# EAGLE design KitchenTimer (EAGLE 9.2.1)
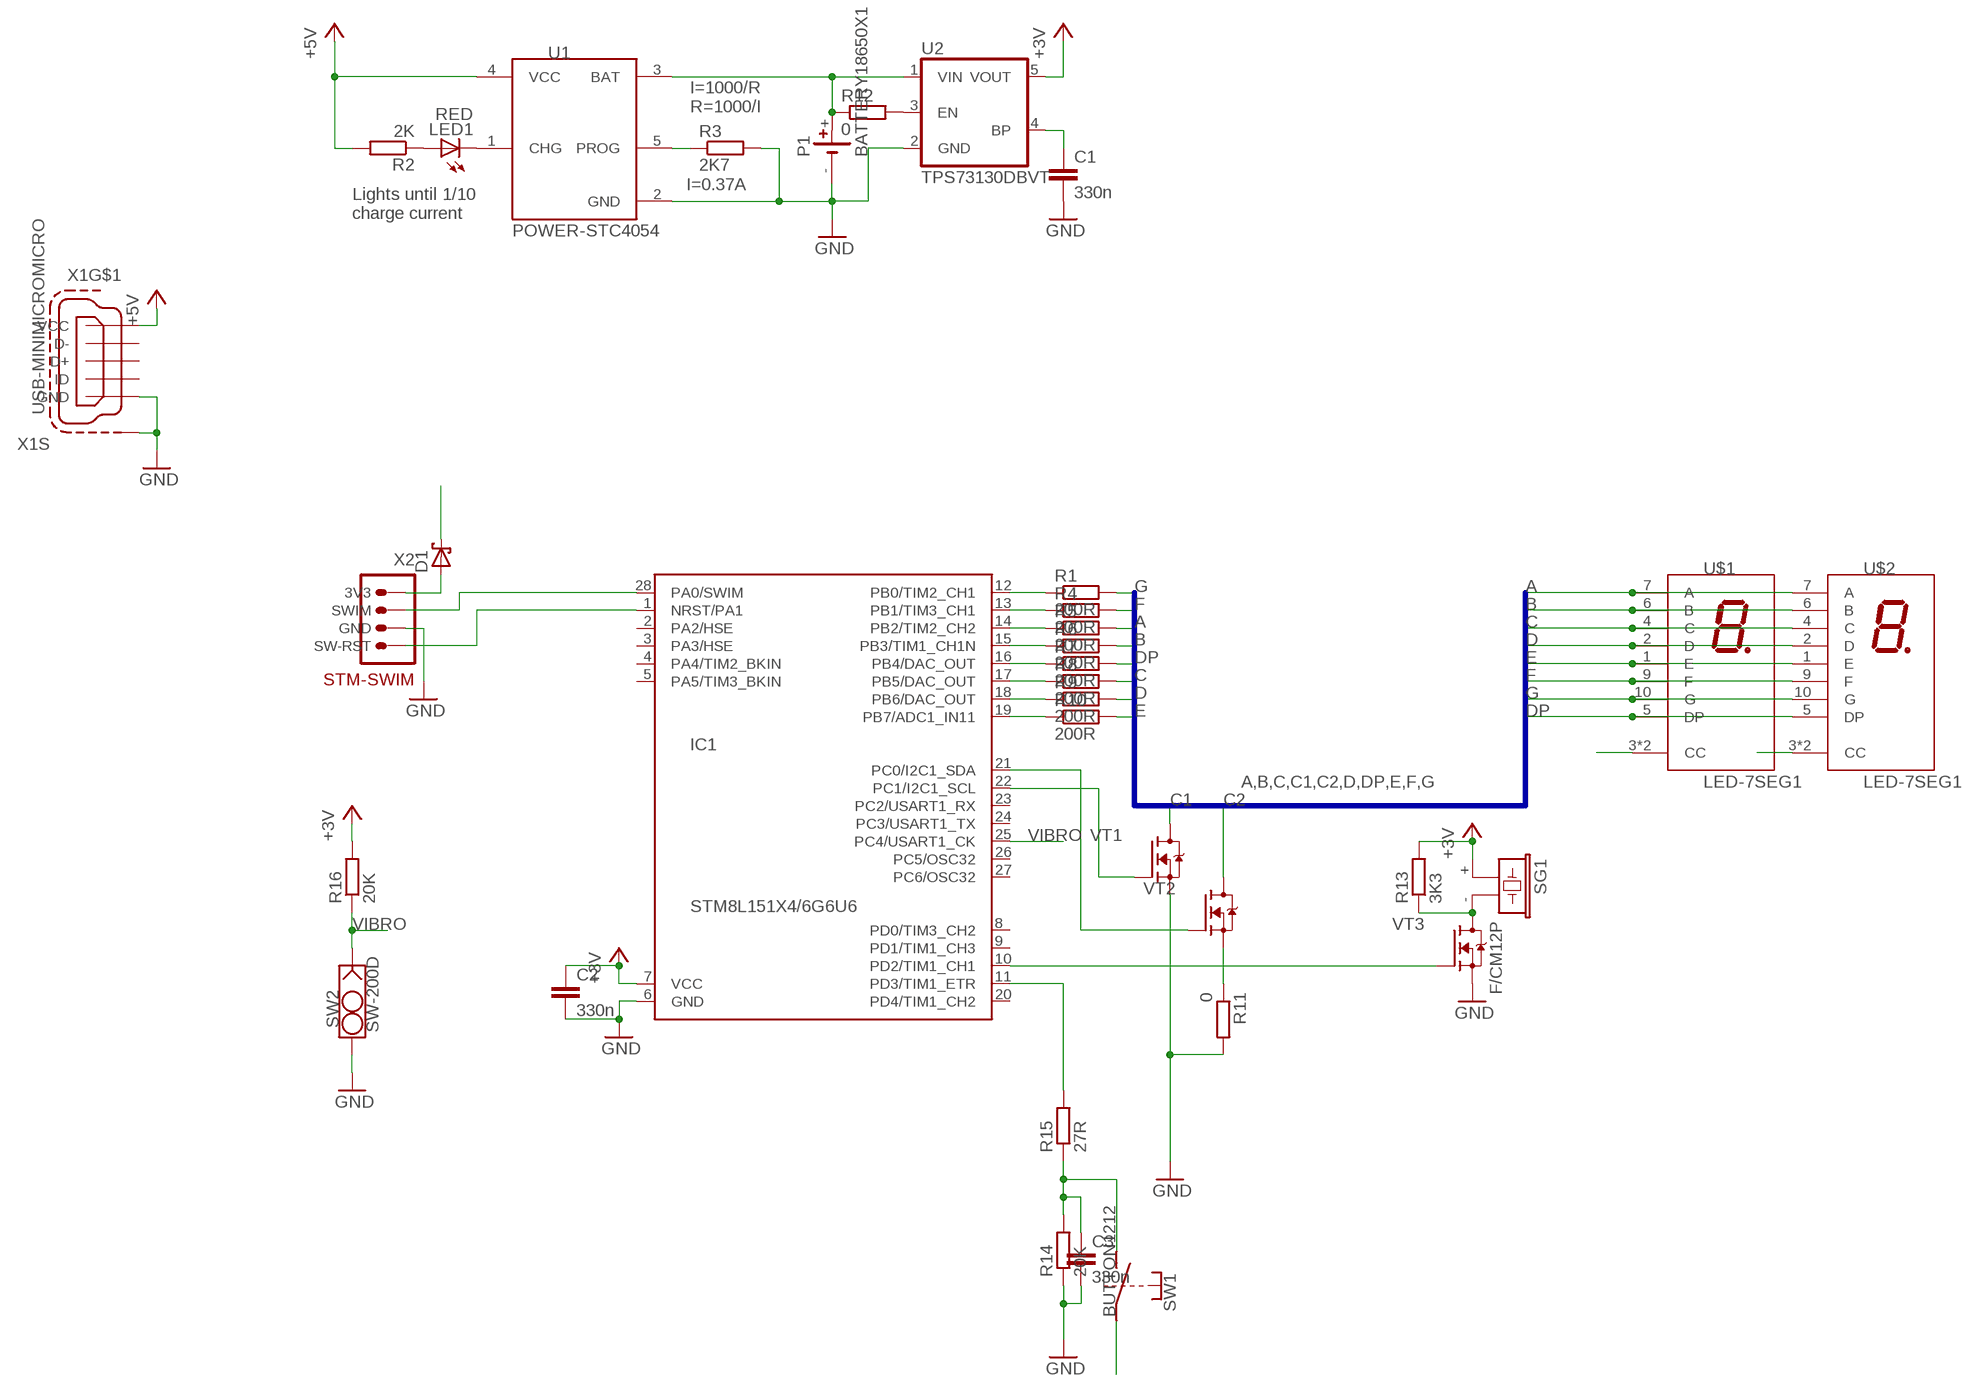
[diagram p0: schematic, sheet 1]

## Parts
C1  330n  CAP_1206  [CAP1206]
C2  330n  CAP_1206  [CAP1206]
C3  330n  CAP_1206  [CAP1206]
D1  DIODE-SH_SOD523  [SODFL1608X65]
IC1  STM8L151X4/6G6U6  [QFN28]
LED1  RED  LED_1206  [LED1206]
P1  BATTERY18650X1  [18650X1_HOLDER]
R1  200R  R_R0805  [RESC2012X50]
R2  2K  R_R0805  [RESC2012X50]
R3  2K7  R_R0805  [RESC2012X50]
R4  200R  R_R0805  [RESC2012X50]
R5  200R  R_R0805  [RESC2012X50]
R6  200R  R_R0805  [RESC2012X50]
R7  200R  R_R0805  [RESC2012X50]
R8  200R  R_R0805  [RESC2012X50]
R9  200R  R_R0805  [RESC2012X50]
R10  200R  R_R0805  [RESC2012X50]
R11  0  R_R0805  [RESC2012X50]
R12  0  R_R0805  [RESC2012X50]
R13  3K3  R_R1206  [RESC3216X60]
R14  20K  R_R1206  [RESC3216X60]
R15  27R  R_R1206  [RESC3216X60]
R16  20K  R_R1206  [RESC3216X60]
SG1  F/CM12P  [F/CM12P]
SW1  BUTTON1212  [B3F-40XX]
SW2  SW-200D  [SW-200D]
U1  POWER-STC4054  [SOT95P280X145-5]
U2  TPS73130DBVT  VREG-LD2985  [SOT95P280X145-5]
U$1  LED-7SEG1  [LED-7SEG1]
U$2  LED-7SEG1  [LED-7SEG1]
VT1  FET-NSOT-23  [SOT95P240X115-3]
VT2  FET-NSOT-23  [SOT95P240X115-3]
VT3  FET-NSOT-23  [SOT95P240X115-3]
X1  USB-MINIMICROMICRO  [USB-B-MICRO-SMD]
X2  STM-SWIMPOGOPADS  [SWIM-PADS-1.27]

## Nets
+3V: C2.1 D1.1(C) IC1.7(VCC) R13.2 R16.2 SG1.+ SW1.1 SW1.2 U2.5(VOUT)
+5V: R2.2 U1.4(VCC) X1.VBUS(VCC)
A: R5.2 U$1.7(A) U$2.7(A)
B: R6.2 U$1.6(B) U$2.6(B)
C: R8.2 U$1.4(C) U$2.4(C)
C1: U$1.3(CC) U$1.8(CC) VT1.3(D)
C2: U$2.3(CC) U$2.8(CC) VT2.3(D)
D: R9.2 U$1.2(D) U$2.2(D)
DP: R7.2 U$1.5(DP) U$2.5(DP)
E: R10.2 U$1.1(E) U$2.1(E)
F: R4.2 U$1.9(F) U$2.9(F)
G: R1.2 U$1.10(G) U$2.10(G)
GND: C1.2 C2.2 C3.2 IC1.6(GND) P1.- R3.2 R11.2 R14.1 SW2.S U1.2(GND) U2.2(GND) VT1.2(S) VT3.2(S) X1.GND X1.SHIELD1(S:S1) X1.SHIELD2(S:S1) X1.SHIELD3(S:S1) X2.P$3(GND)
N$1: LED1.C U1.1(CHG)
N$2: LED1.A R2.1
N$3: IC1.12(PB0/TIM2_CH1) R1.1
N$4: IC1.13(PB1/TIM3_CH1) R4.1
N$5: R3.1 U1.5(PROG)
N$6: IC1.14(PB2/TIM2_CH2) R5.1
N$7: P1.+ R12.1 U1.3(BAT) U2.1(VIN)
N$8: IC1.15(PB3/TIM1_CH1N) R6.1
N$9: IC1.16(PB4/DAC_OUT) R7.1
N$10: IC1.17(PB5/DAC_OUT) R8.1
N$11: IC1.18(PB6/DAC_OUT) R9.1
N$12: IC1.19(PB7/ADC1_IN11) R10.1
N$13: IC1.22(PC1/I2C1_SCL) VT1.1(G)
N$14: IC1.21(PC0/I2C1_SDA) VT2.1(G)
N$15: R11.1 VT2.2(S)
N$16: R12.2 U2.3(EN)
N$17: C1.1 U2.4(BP)
N$18: R13.1 SG1.- VT3.3(D)
N$19: IC1.10(PD2/TIM1_CH1) VT3.1(G)
N$20: C3.1 R14.2 R15.1 SW1.3 SW1.4
N$21: IC1.11(PD3/TIM1_ETR) R15.2
N$22: IC1.28(PA0/SWIM) X2.P$2(SWIM)
N$23: IC1.1(NRST/PA1) X2.P$4(SW-RST)
N$24: D1.2(A) X2.P$1(3V3)
VIBRO: IC1.25(PC4/USART1_CK) R16.1 SW2.G
Unconnected: IC1.2(PA2/HSE) IC1.3(PA3/HSE) IC1.4(PA4/TIM2_BKIN) IC1.5(PA5/TIM3_BKIN) IC1.8(PD0/TIM3_CH2) IC1.9(PD1/TIM1_CH3) IC1.20(PD4/TIM1_CH2) IC1.23(PC2/USART1_RX) IC1.24(PC3/USART1_TX) IC1.26(PC5/OSC32) IC1.27(PC6/OSC32) X1.D+ X1.D- X1.ID

## Buses
A,B,C,C1,C2,D,DP,E,F,G

## Notes on the sheet
- I=1000/R
  R=1000/I
- I=0.37A
- Lights until 1/10
  charge current

## Library data of the parts
C1-C3 = Flamberm:CAP_
D1 = Flamberm:DIODE-SH_
IC1 = Flamberm:STM8L151X4/6
LED1 = Flamberm:LED_
P1 = Flamberm:BATTERY
R1-R16 = Flamberm:R_
SG1 = buzzer:F/CM12P: BUZZER Source: Buerklin; OC_FARNELL: unknown; OC_NEWARK: unknown
SW1 = Flamberm:BUTTON
SW2 = Flamberm:SW-200D
U1 = Flamberm:POWER-STC4054
U2 = Flamberm:VREG-LD2985
U$1 U$2 = Flamberm:LED-7SEG1
VT1-VT3 = Flamberm:FET-N
X1 = Flamberm:USB-MINIMICRO: MINI USB-B Conector Source: www.cypressindustries.com
X2 = Flamberm:STM-SWIM

## Board
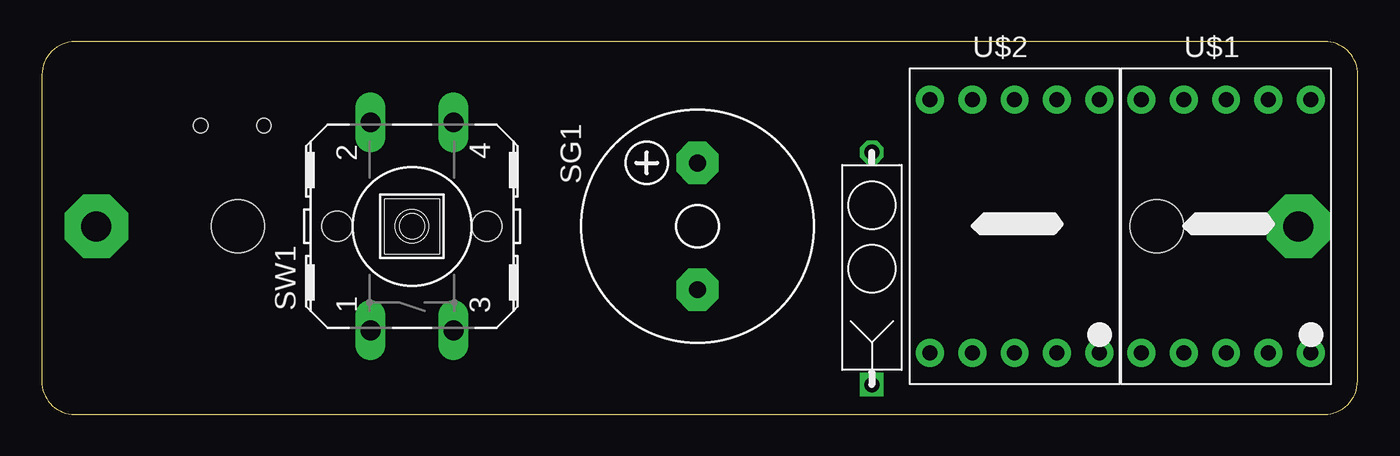
[diagram p1: board, top side]
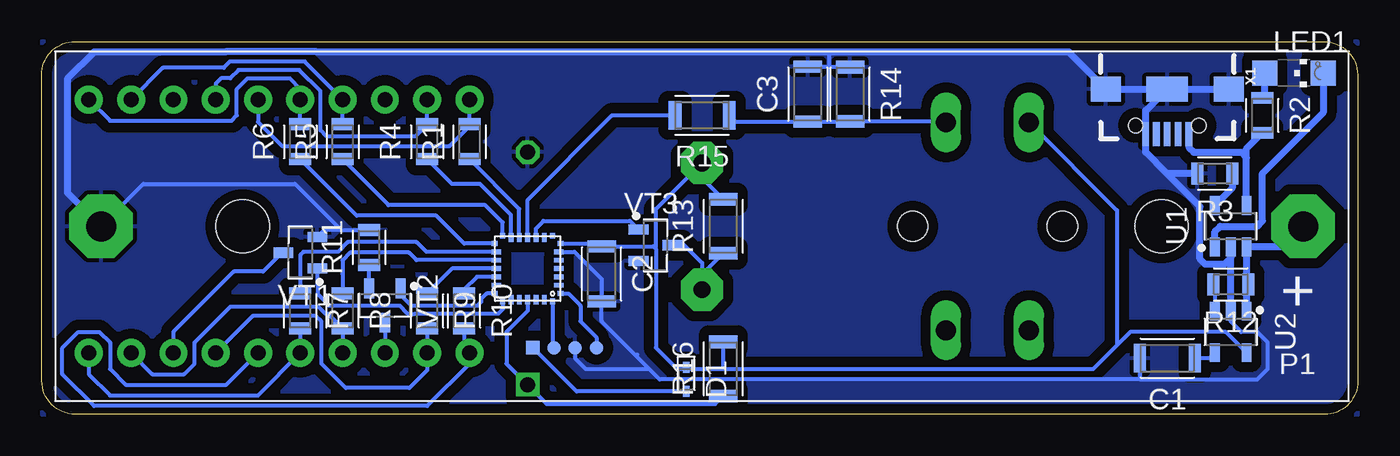
[diagram p2: board, bottom side, seen from below]

Size 79.06 x 22.4 mm. Coordinates in mm from the lower left corner, seen from the top.
Outline: 2,0 77.04,0 arc90 79.04,2 79.06,20.4 arc90 77.06,22.4 2.02,22.4 arc90 0.02,20.4 0,2 arc90 2,0
Copper layers (1*16): Top 0.035mm / dielectric 1.5mm / Bottom 0.035mm
Design rules "EagleDesignRules": minimum track width 0.25mm, minimum drill 0.3mm, track to track 0.25mm, track to pad 0.25mm, pad to pad 0.25mm, via to via 0.25mm, smd to smd 0.25mm, copper to edge 0.5mm, drill to drill 0.5mm, minimum pad ring 10mil, minimum via ring 8mil, stop-mask expansion 4mil, vias tented up to drill 0mil, thermal gap 0.25mm

### Footprints (pad centres in the part's own frame; a part is rotated, then mirrored left to right if it is on the bottom)
CAP1206 = smd 0.712 x 1.712: 1 -1.65,0; 2 1.65,0
SODFL1608X65 = smd 0.66 x 0.398: 1 -0.72,0; 2 0.72,0
QFN28 = smd 0.35 x 0.29: 1 -1.975,1.5; 7 -1.975,-1.5; 15 1.975,-1.5; 21 1.975,1.5 | smd 0.55 x 0.29: 2 -1.875,1; 3 -1.875,0.5; 4 -1.875,0; 5 -1.875,-0.5; 6 -1.875,-1; 16 1.875,-1; 17 1.875,-0.5; 18 1.875,0; 19 1.875,0.5; 20 1.875,1 | smd 0.29 x 0.35: 8 -1.5,-1.975; 14 1.5,-1.975; 22 1.5,1.975; 28 -1.5,1.975 | smd 0.29 x 0.55: 9 -1,-1.875; 10 -0.5,-1.875; 11 0,-1.875; 12 0.5,-1.875; 13 1,-1.875; 23 1,1.875; 24 0.5,1.875; 25 0,1.875; 26 -0.5,1.875; 27 -1,1.875
LED1206 = smd 1.5 x 1.5: A 0,-1.75; C 0,1.75
18650X1_HOLDER = drill 1.8 pad 3.81 octagon: + -36.1,0; - 36.1,0 | hole 3.2: -27.6,0; 27.6,0
RESC2012X50 = smd 0.712 x 1.312: 1 -1.05,0; 2 1.05,0
RESC3216X60 = smd 0.762 x 1.712: 1 -1.625,0; 2 1.625,0
F/CM12P = drill 1.016 pad 2.54 octagon: + 3.81,0; - -3.81,0
B3F-40XX = drill 1.194 long: 1 -6.248,2.489; 2 6.248,2.489; 3 -6.248,-2.489; 4 6.248,-2.489 | hole 1.803: 0,-4.496; 0,4.496
SW-200D = drill 0.9 square: G 6.985,0 | drill 0.9 octagon: S -6.985,0
SOT95P280X145-5 = smd 1.127 x 0.589: 1 -1.242,0.95; 2 -1.242,0; 3 -1.242,-0.95; 4 1.242,-0.95; 5 1.242,0.95
LED-7SEG1 = drill 0.9 pad 1.676: 1 -5.08,-7.62; 2 -2.54,-7.62; 3 0,-7.62; 4 2.54,-7.62; 5 5.08,-7.62; 6 5.08,7.62; 7 2.54,7.62; 8 0,7.62; 9 -2.54,7.62; 10 -5.08,7.62
SOT95P240X115-3 = smd 1.18 x 0.609: 1 -1.024,0.95; 2 -1.024,-0.95; 3 1.024,0
USB-B-MICRO-SMD = smd 1.45 x 0.4: D+ 2.725,0; D- 2.725,0.65; GND 2.725,-1.3; ID 2.725,-0.65; VBUS 2.725,1.3 | smd 1.5 x 1.8: SHIELD1 0,3.685; SHIELD2 0,-3.685 | smd 1.5 x 2.5: SHIELD3 0,0 | hole 0.85: 2.2,1.9; 2.2,-1.9
SWIM-PADS-1.27 = smd 0.8 x 0.8: P$1 -1.27,0; P$2 0,0; P$3 1.27,0; P$4 2.54,0

### Placement (x,y rotation side)
C1  11.45,3.37 180 bottom
C2  45.42,8.45 270 bottom
C3  33.04,19.24 90 bottom
D1  40.34,2.1 270 bottom
IC1  49.87,8.76 180 bottom
LED1  3.83,20.51 270 bottom
P1  39.39,11.3 180 bottom
R1  53.36,16.38 90 bottom
R2  5.73,17.97 270 bottom
R3  8.59,14.48 180 bottom
R4  55.9,16.38 90 bottom
R5  60.98,16.38 90 bottom
R6  63.52,16.38 90 bottom
R7  63.52,6.22 270 bottom
R8  60.98,6.22 270 bottom
R9  55.9,6.22 270 bottom
R10  53.68,6.22 270 bottom
R11  59.39,10.03 90 bottom
R12  7.64,7.81 180 bottom
R13  38.12,11.3 90 bottom
R14  30.5,19.24 270 bottom
R15  39.39,17.97 180 bottom
R16  38.12,2.73 90 bottom
SG1  39.39,11.3 90 top
SW1  22.24,11.3 90 top
SW2  49.87,8.76 270 top
U1  7.64,11.3 90 bottom
U2  7.64,4.95 270 bottom
U$1  71.14,11.3 0 top
U$2  58.44,11.3 0 top
VT1  63.52,9.72 180 bottom
VT2  58.44,6.54 270 bottom
VT3  42.18,10.16 0 bottom
X1  11.45,19.56 270 bottom
X2  48.28,4 0 bottom

### Tracks (layer width: path | path; a pad name or v marks a point on that pad's centre or on a via)
+3V
  Bottom 0.25: U2.5 7.93,4.95 13.67,4.95 14.47,4.16 | 40.34,2.73 40.89,2.73 42.16,4 42.16,9.94 | 40.34,2.73 38.12,2.73 | 38.12,2.73 35.26,2.73 15.89,2.73 14.47,4.16 | IC1.7 45.59,10.26 C2.1 42.31,10.1 42.16,9.94 | 42.16,9.94 42.16,12.34 SG1.+ 39.39,14.2 R13.2 | SW1.2 14.47,12.26 14.47,4.16 | D1.1 40.34,2.73 | R16.2 38.12,2.73
+5V
  Bottom 0.406: U1.4 6.69,15.43 | 6.69,15.43 6.69,15.97 R2.2 | X1.VBUS 10.15,16.04 9.86,15.75 7.01,15.75 6.69,15.43
A
  Bottom 0.254: R5.2 U$2.7 63.26,21.2 67.75,21.2 68.12,20.83 71.77,20.83 U$1.7
B
  Bottom 0.254: R6.2 U$2.6 63.52,19.56 64.15,20.19 66.69,20.19 67.33,19.56 67.33,17.97 67.65,17.65 74.95,17.65 U$1.6
C
  Bottom 0.254: U$2.4 R8.2 61.84,6.04 62,6.04 62.44,6.47 67.71,6.47 69.87,4.32 69.87,3.05 70.5,2.41 72.41,2.41 U$1.4
C1
  Bottom 0.25: 67.52,8.57 65.76,8.57 64.62,9.71 VT1.3
  Bottom 0.254: 67.52,8.57 71.14,4.95 U$1.3
C2
  Bottom 0.25: VT2.3 U$2.3
D
  Bottom 0.254: R9.2 U$2.2 55.9,2.65 56.96,1.59 60.79,1.59 62.25,3.05 62.25,5.57 62.58,5.91 66.38,5.91 U$1.2
DP
  Bottom 0.254: R7.2 U$2.5 66.06,1.14 74.95,1.14 76.22,2.41 U$1.5
E
  Bottom 0.254: R10.2 53.68,4 U$2.1 53.36,3.05 55.9,0.51 75.9,0.51 77.81,2.41 77.81,4 76.85,4.95 75.58,4.95 74.95,4.32 74.95,2.73 74,1.78 67.96,1.78 U$1.1
F
  Bottom 0.254: U$2.9 R4.2 56.63,16.7 60.17,16.7 61.93,16.7 62.3,17.07 62.3,19.43 63.57,20.7 67.22,20.7 67.72,20.19 68.28,20.19 68.6,19.88 U$1.9
G
  Bottom 0.254: U$2.10 R1.2 53.36,17.34 54.56,16.13 64.62,16.13 66.06,17.58 U$1.10
GND
  Bottom 0.25: P1.- 72.95,13.84 63.84,13.84 61.08,11.08 | 61.08,11.08 R11.2 | U2.2 7.64,5.59 7,4.95 6.05,4.95 5.42,4.32 5.42,2.73 6.05,2.1 13.04,2.1 | 13.04,2.1 41.93,2.1 42.56,2.73 | C1.2 13.1,2.16 13.04,2.1 | 42.56,2.73 43.36,3.52 | 43.36,3.52 45.42,5.59 C2.2 45.42,8.13 47.06,9.76 IC1.6 | 43.28,3.6 43.36,3.52 | C3.2 31.77,20.89 | 31.77,20.89 30.52,20.89 R14.1 | 31.77,21.78 31.77,20.89 | X2.P$3 47.01,3.37 46.37,2.73 42.56,2.73 | VT1.2 62.08,11.08 61.08,11.08
  Bottom 0.406: X1.SHIELD3 12.75,18.26 X1.GND 12.75,15.75 11.46,14.46 | X1.SHIELD3 X1.SHIELD2 17.36,21.78 31.77,21.78 62.54,21.78 67.99,21.78 75.9,21.78 77.51,20.17 77.51,13.32 P1.- | X1.SHIELD3 X1.SHIELD1 | U1.2 7.64,9.4 | 7.64,9.4 8.02,9.02 9.16,9.02 9.49,9.34 9.49,12.48 11.46,14.46 | R3.2 9.66,14.46 11.46,14.46 | U2.2 7.64,9.4
  pour Bottom (isolate 0.61, rank 6): 0,0 0.02,22.4 79.06,22.4 79.04,0
N$1
  Bottom 0.406: LED1.C 2.08,18.13 5.73,14.48 5.73,11.62 6.05,11.3 8.27,11.3 8.59,10.99 U1.1
N$2
  Bottom 0.406: R2.1 5.58,19.18 LED1.A
N$3
  Bottom 0.254: IC1.12 50.37,12.34 R1.1
N$4
  Bottom 0.254: IC1.13 50.87,11.99 52.72,13.84 54.41,13.84 R4.1
N$5
  Bottom 0.406: R3.1 7.54,13.59 U1.5
N$6
  Bottom 0.254: IC1.14 51.37,11.53 52.41,12.57 58.22,12.57 R5.1
N$7
  Bottom 0.25: R12.1 6.69,7.81
  Bottom 0.406: P1.+ 4.53,10.06 U1.3 6.69,7.81 U2.1
N$8
  Bottom 0.25: 53.68,10.26 55.35,11.94 60.12,11.94 60.39,12.21
  Bottom 0.254: IC1.15 53.68,10.26 | 60.39,12.21 R6.1
N$9
  Bottom 0.25: 54.31,9.76 55.95,9.76 56.53,10.35 60.66,10.35 61.25,9.76 61.61,9.76
  Bottom 0.254: R7.1 63.52,9.57 63.33,9.76 61.61,9.76 | IC1.16 54.31,9.76
N$10
  Bottom 0.25: 56.53,9.26 56.99,9.71 60.52,9.71 60.98,9.26 60.98,8.44
  Bottom 0.254: IC1.17 56.53,9.26 | 60.98,8.44 R8.1
N$11
  Bottom 0.254: IC1.18 54.41,8.76 R9.1
N$12
  Bottom 0.254: IC1.19 52.91,8.26 53.68,7.49 R10.1
N$13
  Bottom 0.25: IC1.22 51.37,6.31 51.64,6.04 56.64,6.04 57.06,6.04 57.56,6.54 61.79,6.54 62.49,7.24 62.49,7.78 62.49,7.79 VT1.1
N$14
  Bottom 0.25: VT2.1 57.49,7.18 56.85,6.54 52.87,6.54 52.65,6.76 52.65,6.94 52.32,7.26 IC1.21
N$15
  Bottom 0.25: VT2.2 R11.1
N$16
  Bottom 0.25: R12.2 8.59,7.71 U2.3
N$17
  Bottom 0.25: U2.4 8.93,3.37 C1.1
N$18
  Bottom 0.25: VT3.3 40.45,10.16 39.39,9.1 SG1.- 39.39,8.41 R13.1
N$19
  Bottom 0.25: IC1.10 49.37,11.17 48.91,11.62 43.72,11.62 VT3.1
N$20
  Bottom 0.25: R15.1 37.38,17.59 C3.1 30.52,17.59 R14.2 24.8,17.62 SW1.4
N$21
  Bottom 0.25: IC1.11 49.87,12.89 44.79,17.97 R15.2
N$22
  Bottom 0.25: IC1.28 48.37,4.09 X2.P$2
N$23
  Bottom 0.25: IC1.1 47.41,7.26 46.69,6.54 46.69,5.59 45.74,4.64 X2.P$4
N$24
  Bottom 0.25: D1.2 46.92,1.38 X2.P$1
VIBRO
  Bottom 0.25: R16.1 38.6,0.62 48.71,0.62 SW2.G 51.14,3.05 51.14,4.95 49.87,6.22 IC1.25